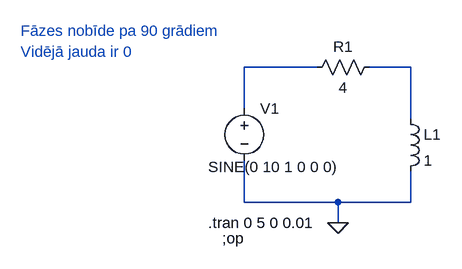
[diagram p0: schematic L (induktivs elements).asc]
L (induktivs elements).asc, the LTspice schematic file:
Version 4
SHEET 1 880 680
WIRE 176 80 64 80
WIRE 320 80 256 80
WIRE 64 144 64 80
WIRE 320 160 320 80
WIRE 64 288 64 224
WIRE 208 288 64 288
WIRE 320 288 320 240
WIRE 320 288 208 288
WIRE 208 320 208 288
FLAG 208 320 0
SYMBOL voltage 64 128 R0
WINDOW 3 -56 106 Left 2
WINDOW 123 0 0 Left 0
WINDOW 39 0 0 Left 0
SYMATTR InstName V1
SYMATTR Value SINE(0 10 1 0 0 0)
SYMBOL res 272 64 R90
WINDOW 0 0 56 VBottom 2
WINDOW 3 32 56 VTop 2
SYMATTR InstName R1
SYMATTR Value 4
SYMBOL ind 304 144 R0
SYMATTR InstName L1
SYMATTR Value 1
SYMATTR SpiceLine Rser=0
TEXT 30 344 Left 2 !;op
TEXT 8 320 Left 2 !.tran 0 5 0 0.01
TEXT -280 24 Left 2 ;Fāzes nobīde pa 90 grādiem
TEXT -280 56 Left 2 ;Vidējā jauda ir 0

The netlist it stands for:
* L (induktivs elements).asc
V1 N001 0 SINE(0 10 1 0 0 0)
R1 N002 N001 4
L1 N002 0 1 Rser=0
;op
.tran 0 5 0 0.01
* Fāzes nobīde pa 90 grādiem
* Vidējā jauda ir 0
.backanno
.end